# Altium schematic sheet USBHUB.SchDoc
size A4; PageSetup: Record=PageOptions|CenterHorizontal=True|CenterVertical=True|PrintScale=0.97|XCorrection=1.00|YCorrection=1.00|PrintKind=0|BorderSize=5000000|LeftOffset=0|BottomOffset=0|Orientation=2|PaperLength=1000|PaperWidth=1000|Scale=100|PaperSource=7|PrintQuality=-3|MediaType=1|DitherType=10|PrintScaleMode=1|PaperKind=A4|PaperIndex=9
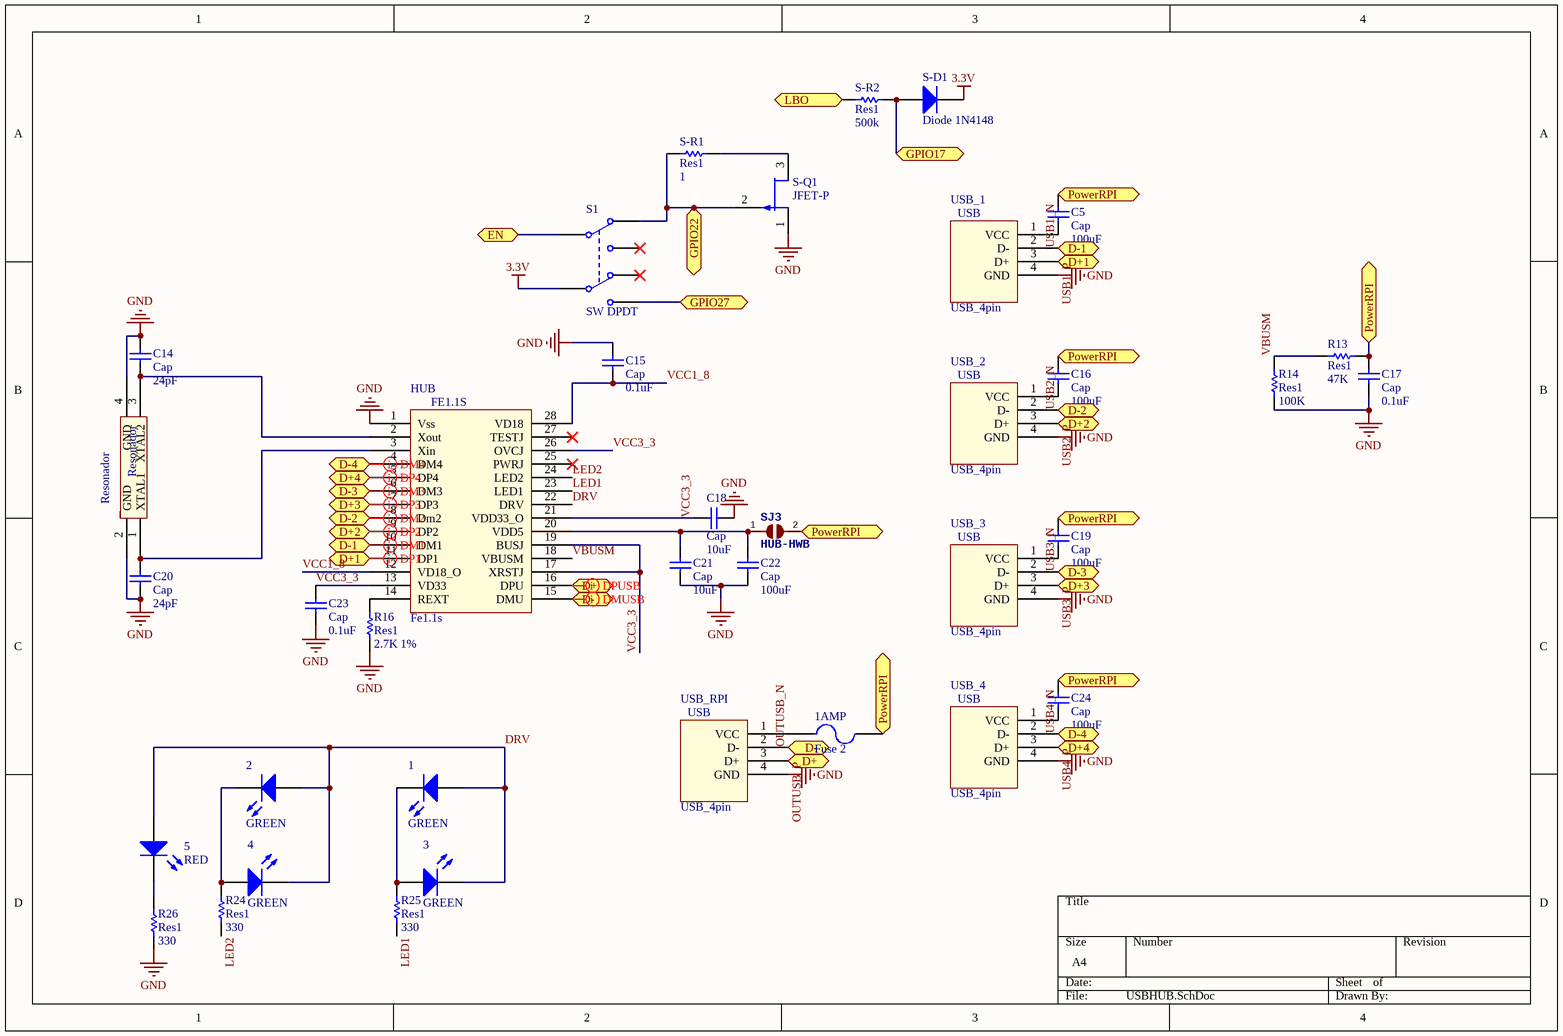
[diagram p0: USBHUB.SchDoc]

## Parts
1  GREEN  [0805]
1AMP  Fuse 2  [0603]
2  GREEN  [0805]
3  GREEN  [0805]
4  GREEN  [0805]
5  RED  [0805]
C5  Cap  value 100uF  [1206]
C14  Cap  value 24pF  [0603]
C15  Cap  value 0.1uF  [0603]
C16  Cap  value 100uF  [1206]
C17  Cap  value 0.1uF  [0603]
C18  Cap  value 10uF  [1206]
C19  Cap  value 100uF  [1206]
C20  Cap  value 24pF  [0603]
C21  Cap  value 10uF  [1206]
C22  Cap  value 100uF  [1206]
C23  Cap  value 0.1uF  [0603]
C24  Cap  value 100uF  [1206]
HUB  Fe1.1s  [fe1.1s]
R13  Res1  value 47K  [1206]
R14  Res1  value 100K  [1206]
R16  Res1  value 2.7K 1%  [1206]
R24  Res1  value 330  [1206]
R25  Res1  value 330  [1206]
R26  Res1  value 330  [1206]
S1  SW DPDT  [Switch]
S-D1  Diode 1N4148  [D1n4148]
S-Q1  JFET-P  [SOT-23 TO236]
S-R1  Res1  value 1  [1206]
S-R2  Res1  value 500k  [1206]
SJ3  HUB-HWB  [JUMPER]
USB_1  USB_4pin  [USBPADS]
USB_2  USB_4pin  [USBPADS]
USB_3  USB_4pin  [USBPADS]
USB_4  USB_4pin  [USBPADS]
USB_RPI  USB_4pin  [USBPADS]
X5  SMD-CRYSTAL-16MHZ-9PF-Resonador  [Res12MHZ-smd]  (value not drawn)

## Ports
D+, D+1, D+2, D+3, D+4, D-, D-1, D-2, D-3, D-4, EN, GPIO17, GPIO22, GPIO27, LBO, PowerRPI

## Nets
3.3V: S1.5(COMMON2) S-D1.2(K)
GND: C14.2 C15.2 C17.1 C18.2 C20.1 C21.1 C22.1 C23.1 HUB.1(Vss) R14.1 R16.1 R26.1 S-Q1.1(D) USB_1.4(GND) USB_2.4(GND) USB_3.4(GND) USB_4.4(GND) USB_RPI.4(GND) X5.2(GND) X5.4(GND)
DRV: 1.1(A) 2.1(A) 3.2(K) 4.2(K) 5.1(A) HUB.22(DRV)
EN: S1.1(COMMON1) ; port EN
GPIO17: S-D1.1(A) S-R2.2 ; port GPIO17
GPIO22: S1.2(NC1) S-Q1.2(G) S-R1.1 ; port GPIO22
GPIO27: S1.6(NO2) ; port GPIO27
LBO: S-R2.1 ; port LBO
LED1: HUB.23(LED1) R25.1
LED2: HUB.24(LED2) R24.1
OUTUSB_N: HUB.15(DMU) USB_RPI.2(D-) ; port D-
OUTUSB_P: HUB.16(DPU) USB_RPI.3(D+) ; port D+
PowerRPI: 1AMP.2 C5.2 C16.2 C17.2 C19.2 C24.2 R13.2 SJ3.2 ; port PowerRPI
USB1_N: HUB.10(DM1) USB_1.2(D-) ; port D-1
USB1_P: HUB.11(DP1) USB_1.3(D+) ; port D+1
USB2_N: HUB.8(Dm2) USB_2.2(D-) ; port D-2
USB2_P: HUB.9(DP2) USB_2.3(D+) ; port D+2
USB3_N: HUB.6(DM3) USB_3.2(D-) ; port D-3
USB3_P: HUB.7(DP3) USB_3.3(D+) ; port D+3
USB4_N: HUB.4(DM4) USB_4.2(D-) ; port D-4
USB4_P: HUB.5(DP4) USB_4.3(D+) ; port D+4
VBUSM: HUB.18(VBUSM) R13.1 R14.2
VCC1_8: C15.2 HUB.12(VD18_O) HUB.28(VD18)
VCC3_3: C18.1 C23.2 HUB.13(VD33) HUB.17(XRSTJ) HUB.19(BUSJ) HUB.21(VDD33_O) HUB.26(OVCJ)
Net1_2: 1.2(K) 3.1(A) R25.2
Net1AMP_1: 1AMP.1 USB_RPI.1(VCC)
Net2_2: 2.2(K) 4.1(A) R24.2
Net5_2: 5.2(K) R26.2
NetC5_1: C5.1 USB_1.1(VCC)
NetC14_1: C14.1 HUB.2(Xout) X5.3(XTAL2)
NetC16_1: C16.1 USB_2.1(VCC)
NetC19_1: C19.1 USB_3.1(VCC)
NetC20_2: C20.2 HUB.3(Xin) X5.1(XTAL1)
NetC21_2: C21.2 C22.2 HUB.20(VDD5) SJ3.1
NetC24_1: C24.1 USB_4.1(VCC)
NetHUB_14: HUB.14(REXT) R16.2
NetS-Q1_3: S-Q1.3(S) S-R1.2

Not connected (* = marked no-connect by the designer): HUB 25(PWRJ)* 27(TESTJ)*; S1 3(NO1)* 4(NC2)*

## Layout directives
differential pair; net class DIFF90: OUTUSB_N, OUTUSB_P, USB1_N, USB1_P, USB2_N, USB2_P, USB3_N, USB3_P, USB4_N, USB4_P

## Notes on the sheet
- (in symbol Fe1.1s) FE1.1S
- (in symbol SMD-CRYSTAL-16MHZ-9PF-10PPM-60R(4P-3.2X2.5MM)) Resonador
- (in symbol USB_4pin) USB

## Library data of the parts
1-5 = LED3: Typical BLUE SiC LED; Published: 8-Jun-2000; LatestRevisionDate: 17-Dec-2003; LatestRevisionNote: PCB Footprint replaced.; DatasheetVersion: 16-Apr-2002; PackageVersion: 16-Apr-2002; PackageReference: 3.5X2.8X1.9; Publisher: Altium Limited; PackageDescription: SM LED; 2 C-Bend Leads; Body 3.5 x 2.8 x 1.9 mm, inc leads (LxWxH typ)
1AMP = Fuse 2: Fuse; Published: 8-Jun-2000; LatestRevisionDate: 17-Jul-2002; LatestRevisionNote: Re-released for DXP Platform.; PackageReference: PIN-W2/E2.8; Publisher: Altium Limited; PackageDescription: Thru-Hole; 2 Leads
C5 C14-C24 = Cap: Capacitor; Published: 8-Jun-2000; LatestRevisionDate: 17-Jul-2002; LatestRevisionNote: Re-released for DXP Platform.; PackageReference: RAD-0.3; Publisher: Altium Limited; PackageDescription: Radial Cap, Thru-Hole; 2 Leads; 0.3 in Pin Spacing
R13 R14 R16 R24-R26 S-R1 S-R2 = Res1: Resistor; Published: 8-Jun-2000; LatestRevisionDate: 17-Jul-2002; LatestRevisionNote: Re-released for DXP Platform.; PackageReference: AXIAL-0.3; Publisher: Altium Limited; PackageDescription: Axial Device, Thru-Hole; 2 Leads; 0.3 in Pin Spacing
S1 = SW DPDT: Switch; Published: 24-Mar-1999; LatestRevisionDate: 29-May-2009; LatestRevisionNote: IPC-7351 Footprint Added.; PackageVersion: Mar-2001; PackageReference: SOT23-6; Publisher: Altium Limited; PackageDescription: 6-Pin SOT-23 Package 0.95 mm Pitch, 2.7 mm Lead Span; Code_JEITA: SC-74; Code_IPC: SOT26A-6
S-D1 = Diode 1N4148: High Conductance Fast Diode; Published: 8-Jun-2000; LatestRevisionDate: 17-Jul-2002; LatestRevisionNote: Re-released for DXP Platform.; DatasheetVersion: 1997; PackageReference: DO-35; Publisher: Altium Limited; PackageDescription: Diode, Axial; Body 3.8 x 1.9 mm (LxDia. max), Lead Dia. 0.53 mm (max); Code_JEDEC: DO-204-AH; ComponentLink1Description: Manufacturer Link; ComponentLink1URL: http://www.fairchildsemi.com/; ComponentLink2Description: Datasheet; ComponentLink2URL: http://www.fairchildsemi.com/ds/1N%2F1N4148.pdf
S-Q1 = JFET-P: P-Channel JFET; Published: 8-Jun-2000; LatestRevisionDate: 17-Jul-2002; LatestRevisionNote: Re-released for DXP Platform.; PackageReference: TO-18A; Publisher: Altium Limited; PackageDescription: SC-89; 3 Flat Leads; Body 1.6 x 1.6 x 0.7 mm, inc leads (LxWxH typ)
SJ3 = SJ: SMD solder JUMPER
X5 = SMD-CRYSTAL-16MHZ-9PF-10PPM-60R(4P-3.2X2.5MM): SMD Crystal 16MHz-9pF-10ppm-60R;; MF: Epson; MP: TSX-3225 16.0000MF18X-AC3; Package: 1210 Epson; Price: 0.38 USD; Availability: Bad; Value: *